# Altium schematic sheet Bluetooth_NRF.SchDoc
size A4
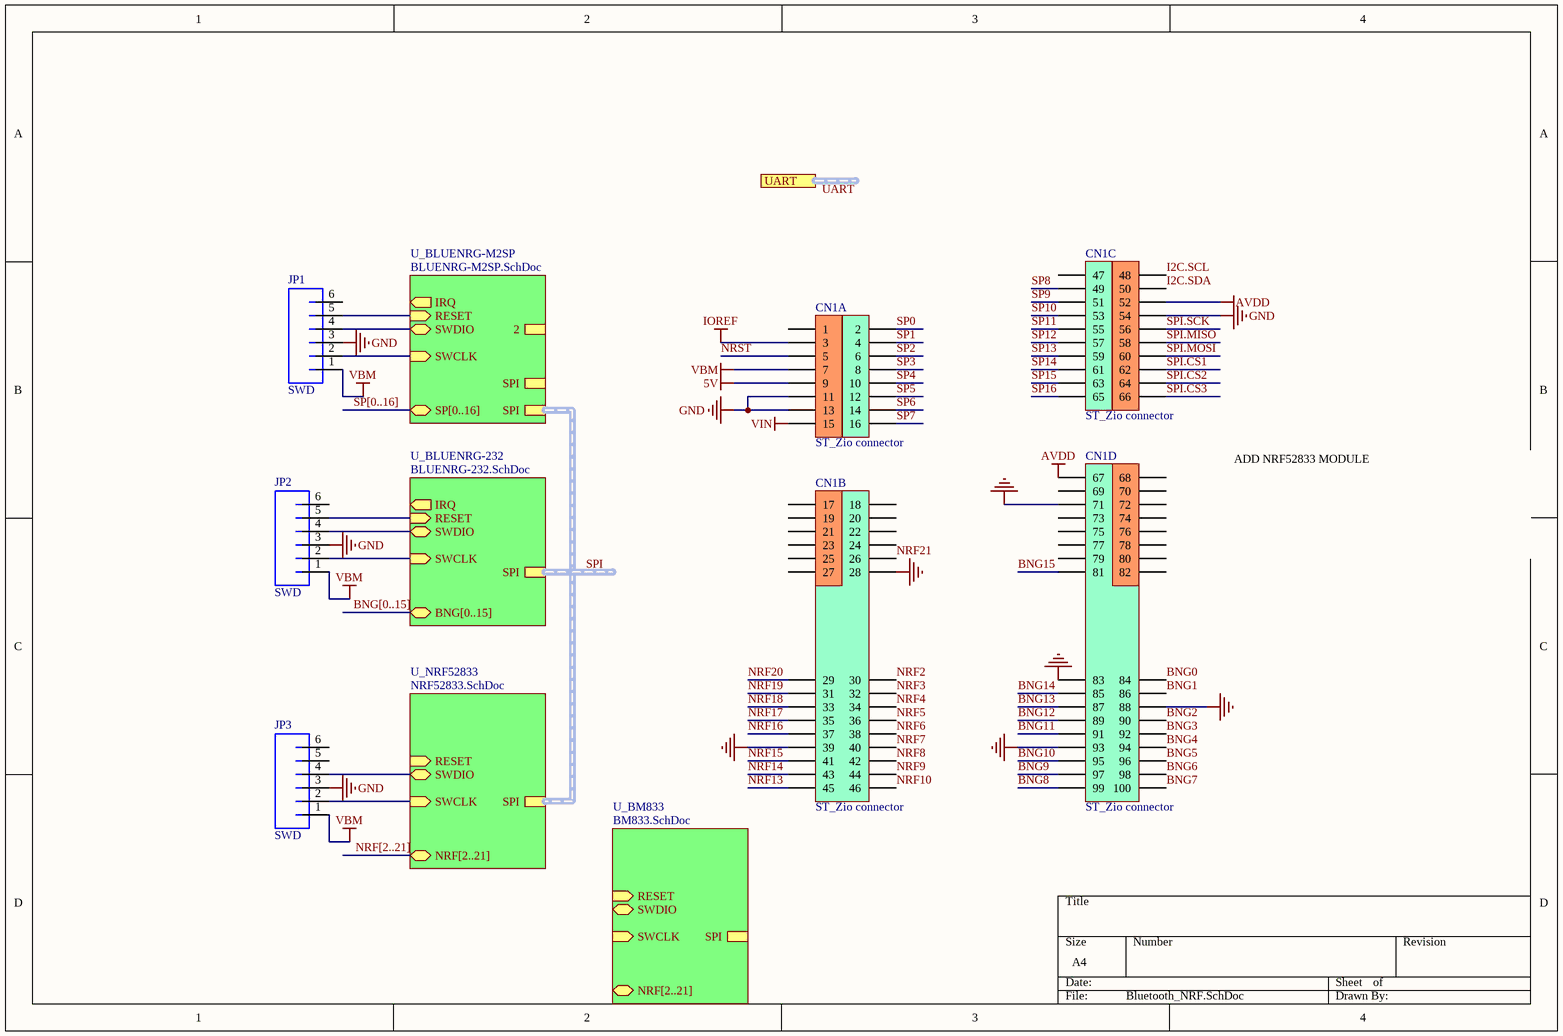
[diagram p0: Bluetooth_NRF.SchDoc]

## Parts
CN1  ST_Zio connector  [ST_Zio]  (parts A,B,C,D of 4)
JP1  SWD  [MOLEX_5045_6]
JP2  SWD  [MOLEX_5045_6]
JP3  SWD  [MOLEX_5045_6]

## Sub-sheets
U_BLUENRG-232 = BLUENRG-232.SchDoc: BNG[0..15] (bidir), IRQ (out), RESET (in), SWCLK (in), SWDIO (bidir), SPI (harness SPI)
U_BLUENRG-M2SP = BLUENRG-M2SP.SchDoc: IRQ (out), RESET (in), 2, SWCLK (in), SWDIO (bidir), SPI, SPI (harness SPI), SP[0..16] (bidir)
U_BM833 = BM833.SchDoc: NRF[2..21] (bidir), RESET (in), SWCLK (in), SWDIO (bidir), SPI (harness SPI)
U_NRF52833 = NRF52833.SchDoc: NRF[2..21] (bidir), RESET (in), SWCLK (in), SWDIO (bidir), SPI (harness SPI)

## Ports
UART (harness USART2)

## Nets
5V: CN1.9
AVDD: CN1.52 CN1.67
GND: CN1.11 CN1.13 CN1.28 CN1.39 CN1.54 CN1.71 CN1.83 CN1.88 CN1.93 JP1.3 JP2.3 JP3.3
IOREF: CN1.3
VBM: CN1.7 JP1.1 JP2.1 JP3.1
VIN: CN1.15
BNG0: CN1.84
BNG1: CN1.86
BNG2: CN1.90
BNG3: CN1.92
BNG4: CN1.94
BNG5: CN1.96
BNG6: CN1.98
BNG7: CN1.100
BNG8: CN1.99
BNG9: CN1.97
BNG10: CN1.95
BNG11: CN1.91
BNG12: CN1.89
BNG13: CN1.87
BNG14: CN1.85
BNG15: CN1.81
I2C.SCL: CN1.48
I2C.SDA: CN1.50
NRF2: CN1.30
NRF3: CN1.32
NRF4: CN1.34
NRF5: CN1.36
NRF6: CN1.38
NRF7: CN1.40
NRF8: CN1.42
NRF9: CN1.44
NRF10: CN1.46
NRF13: CN1.45
NRF14: CN1.43
NRF15: CN1.41
NRF16: CN1.37
NRF17: CN1.35
NRF18: CN1.33
NRF19: CN1.31
NRF20: CN1.29
NRF21: CN1.26
NRST: CN1.5
SP0: CN1.2
SP1: CN1.4
SP2: CN1.6
SP3: CN1.8
SP4: CN1.10
SP5: CN1.12
SP6: CN1.14
SP7: CN1.16
SP8: CN1.49
SP9: CN1.51
SP10: CN1.53
SP11: CN1.55
SP12: CN1.57
SP13: CN1.59
SP14: CN1.61
SP15: CN1.63
SP16: CN1.65
SPI.CS1: CN1.62
SPI.CS2: CN1.64
SPI.CS3: CN1.66
SPI.MISO: CN1.58
SPI.MOSI: CN1.60
SPI.SCK: CN1.56
NetJP1_2: JP1.2 ; sheet U_BLUENRG-M2SP/SWCLK
NetJP1_4: JP1.4 ; sheet U_BLUENRG-M2SP/SWDIO
NetJP1_5: JP1.5 ; sheet U_BLUENRG-M2SP/RESET
NetJP2_2: JP2.2 ; sheet U_BLUENRG-232/SWCLK
NetJP2_4: JP2.4 ; sheet U_BLUENRG-232/SWDIO
NetJP2_5: JP2.5 ; sheet U_BLUENRG-232/RESET
NetJP3_2: JP3.2 ; sheet U_NRF52833/SWCLK
NetJP3_4: JP3.4 ; sheet U_NRF52833/SWDIO

Not connected (* = marked no-connect by the designer): CN1 1 17 18 19 20 21 22 23 24 25 27 47 68 69 70 72 73 74 75 76 77 78 79 80 82; JP1 6; JP2 6; JP3 5 6

## Buses and harness runs
bus BNG[0..15] = sheet U_BLUENRG-232/BNG[0..15]
bus NRF[2..21] = sheet U_NRF52833/NRF[2..21]
bus SP[0..16] = sheet U_BLUENRG-M2SP/SP[0..16]
harness SPI = sheet U_BLUENRG-232/SPI = sheet U_BLUENRG-M2SP/SPI = sheet U_NRF52833/SPI
harness UART = port UART

## Notes on the sheet
- ADD NRF52833 MODULE

## Library data of the parts
JP1-JP3 = MOLEX_5045_6: PartNumber: B6B-PH-K-S(LF)(SN); Manufacturer: JST Sales America Inc.; PackageReference: JST-PH; Mounting Technology: Through Hole